# Altium schematic sheet 智能灯.SchDoc
size A3
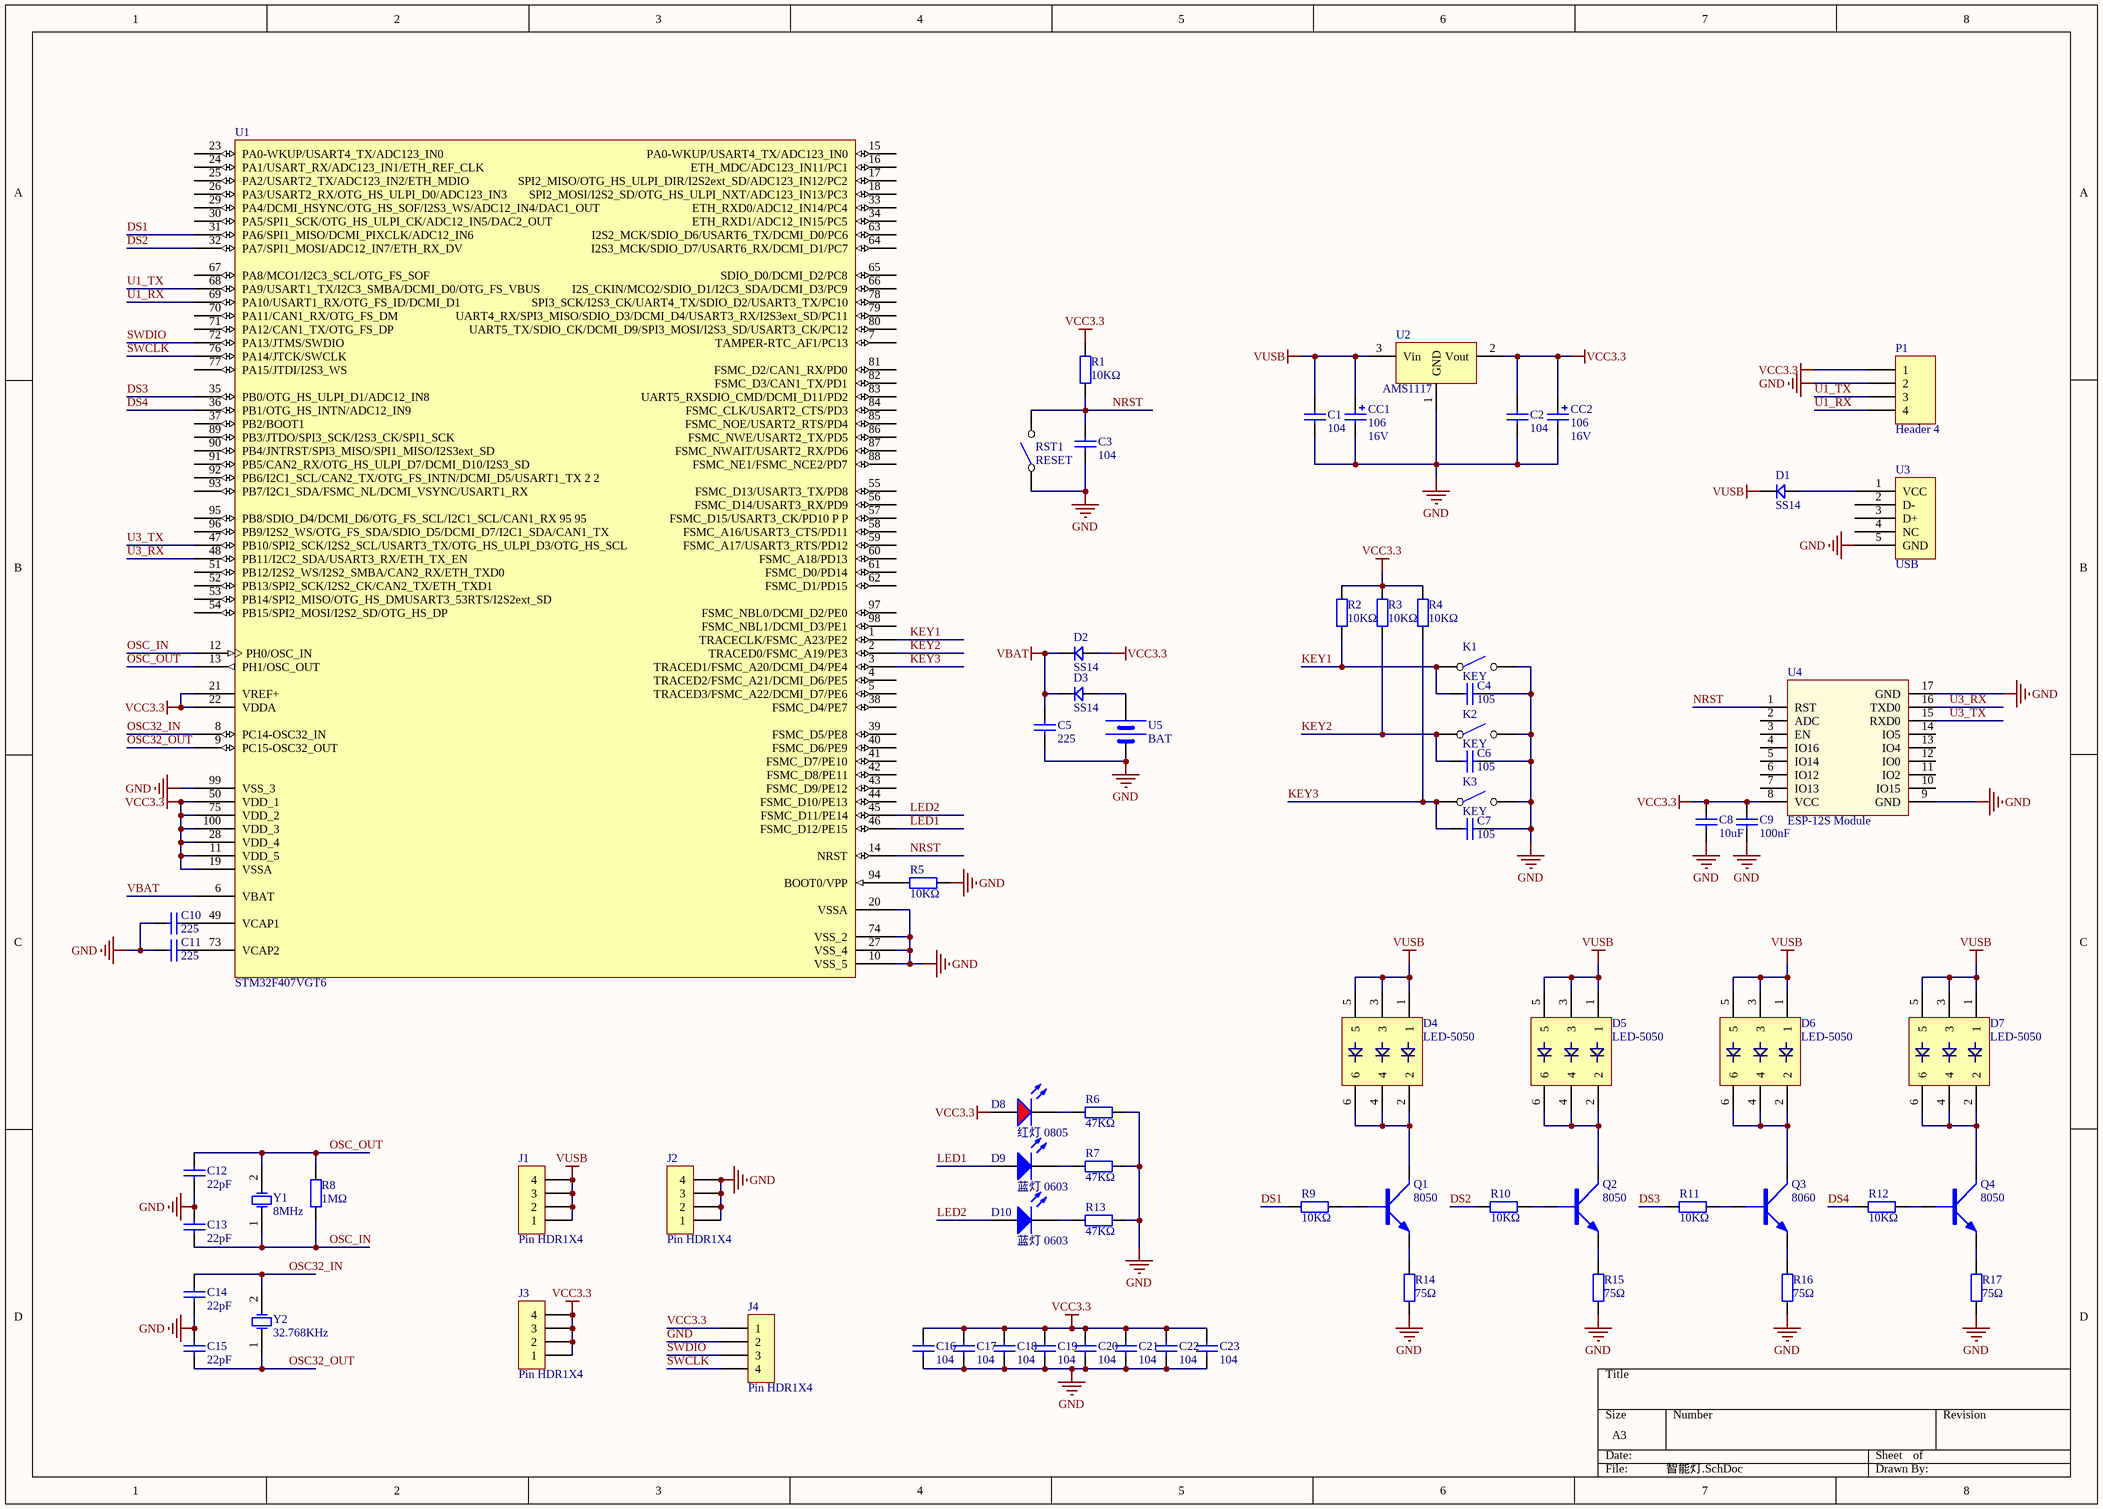
[diagram p0: 智能灯.SchDoc]

## Parts
C1  104  [LC-0805_C]
C2  104  [LC-0805_C]
C3  104  [LC-0805_C]
C4  105  [LC-0805_C]
C5  225  [LC-0805_C]
C6  105  [LC-0805_C]
C7  105  [LC-0805_C]
C8  10uF  [LC-0805_C]
C9  100nF  [LC-0805_C]
C10  225  [LC-0805_C]
C11  225  [LC-0805_C]
C12  22pF  [LC-0805_C]
C13  22pF  [LC-0805_C]
C14  22pF  [LC-0805_C]
C15  22pF  [LC-0805_C]
C16  104  [LC-0805_C]
C17  104  [LC-0805_C]
C18  104  [LC-0805_C]
C19  104  [LC-0805_C]
C20  104  [LC-0805_C]
C21  104  [LC-0805_C]
C22  104  [LC-0805_C]
C23  104  [LC-0805_C]
CC1  Capacitance: 106  Voltage: 16V  [TAN-C-6032]  (hidden comment: Cap Tan C)
CC2  Capacitance: 106  Voltage: 16V  [TAN-C-6032]  (hidden comment: Cap Tan C)
D1  SS14  [LC-SOD-123]
D2  SS14  [LC-SOD-123]
D3  SS14  [LC-SOD-123]
D4  LED-5050  [LED-5050W]
D5  LED-5050  [LED-5050W]
D6  LED-5050  [LED-5050W]
D7  LED-5050  [LED-5050W]
D8  红灯 0805  [LC-0805_LED_S1]
D9  蓝灯 0603  [LC-0805_LED_S1]
D10  蓝灯 0603  [LC-0805_LED_S1]
J1  Pin HDR1X4  [Pin HDR1X4/2.54mm-S]
J2  Pin HDR1X4  [Pin HDR1X4/2.54mm-S]
J3  Pin HDR1X4  [Pin HDR1X4/2.54mm-S]
J4  Pin HDR1X4  [Pin HDR1X4/2.54mm-S]
K1  KEY  [KEY_2]
K2  KEY  [KEY_2]
K3  KEY  [KEY_2]
P1  Header 4  [HDR1X4]
Q1  8050  [SOT-23]
Q2  8050  [SOT-23]
Q3  8060  [SOT-23]
Q4  8050  [SOT-23]
R1  10KΩ  [LC-0805_R]
R2  10KΩ  [LC-0805_R]
R3  10KΩ  [LC-0805_R]
R4  10KΩ  [LC-0805_R]
R5  10KΩ  [LC-0805_R]
R6  47KΩ  [LC-0805_R]
R7  47KΩ  [LC-0805_R]
R8  1MΩ  [LC-0805_R]
R9  10KΩ  [LC-0805_R]
R10  10KΩ  [0805R]
R11  10KΩ  [0805R]
R12  10KΩ  [0805R]
R13  47KΩ  [LC-0805_R]
R14  75Ω  [0805R]
R15  75Ω  [0805R]
R16  75Ω  [0805R]
R17  75Ω  [0805R]
RST1  RESET  [KEY_2]
U1  STM32F407VGT6  [LQFP100 14x14]
U2  AMS1117  [SOT-223]
U3  USB  [USB_B]
U4  ESP-12S Module  [ESP-12S Module]
U5  BAT  [CR1220_A]
Y1  8MHz  [XTAL-SMD]
Y2  32.768KHz  [OSC-3x8-WI-B]

## Nets
GND: C1.1 C2.1 C3.1 C4.2 C5.1 C6.2 C7.2 C8.1 C9.1 C10.1 C11.1 C12.1 C13.2 C14.1 C15.2 C16.1 C17.1 C18.1 C19.1 C20.1 C21.1 C22.1 C23.1 CC1.1 CC2.1 J2.1 J2.2 J2.3 J2.4 J4.2 K1.2 K2.2 K3.2 P1.2 R5.2 R6.2 R7.2 R13.2 R14.2 R15.2 R16.2 R17.2 RST1.1 U1.10(VSS_5) U1.20(VSSA) U1.27(VSS_4) U1.74(VSS_2) U1.99(VSS_3) U2.1(GND) U3.5(GND) U4.9(GND) U4.17(GND) U5.2(GND)
VBAT: C5.2 D2.2 D3.2 U1.6(VBAT)
VCC3.3: C2.2 C8.2 C9.2 C16.2 C17.2 C18.2 C19.2 C20.2 C21.2 C22.2 C23.2 CC2.2 D2.1 D8.A J3.1 J3.2 J3.3 J3.4 J4.1 P1.1 R1.2 R2.2 R3.2 R4.2 U1.11(VDD_5) U1.19(VSSA) U1.21(VREF+) U1.22(VDDA) U1.28(VDD_4) U1.50(VDD_1) U1.75(VDD_2) U1.100(VDD_3) U2.2(Vout) U4.8(VCC)
VUSB: C1.2 CC1.2 D1.2 D4.1 D4.3 D4.5 D5.1 D5.3 D5.5 D6.1 D6.3 D6.5 D7.1 D7.3 D7.5 J1.1 J1.2 J1.3 J1.4 U2.3(Vin)
DS1: R9.2 U1.31(PA6/SPI1_MISO/DCMI_PIXCLK/ADC12_IN6)
DS2: R10.2 U1.32(PA7/SPI1_MOSI/ADC12_IN7/ETH_RX_DV)
DS3: R11.2 U1.35(PB0/OTG_HS_ULPI_D1/ADC12_IN8)
DS4: R12.2 U1.36(PB1/OTG_HS_INTN/ADC12_IN9)
KEY1: C4.1 K1.1 R2.1 U1.1(TRACECLK/FSMC_A23/PE2)
KEY2: C6.1 K2.1 R3.1 U1.2(TRACED0/FSMC_A19/PE3)
KEY3: C7.1 K3.1 R4.1 U1.3(TRACED1/FSMC_A20/DCMI_D4/PE4)
LED1: D9.A U1.46(FSMC_D12/PE15)
LED2: D10.A U1.45(FSMC_D11/PE14)
NRST: C3.2 R1.1 RST1.2 U1.14(NRST) U4.1(RST)
OSC32_IN: C14.2 U1.8(PC14-OSC32_IN) Y2.2(OSC2)
OSC32_OUT: C15.1 U1.9(PC15-OSC32_OUT) Y2.1(OSC1)
OSC_IN: C13.1 R8.1 U1.12(PH0/OSC_IN) Y1.1(OSC1)
OSC_OUT: C12.2 R8.2 U1.13(PH1/OSC_OUT) Y1.2(OSC2)
SWCLK: J4.4 U1.76(PA14/JTCK/SWCLK)
SWDIO: J4.3 U1.72(PA13/JTMS/SWDIO)
U1_RX: P1.4 U1.69(PA10/USART1_RX/OTG_FS_ID/DCMI_D1)
U1_TX: P1.3 U1.68(PA9/USART1_TX/I2C3_SMBA/DCMI_D0/OTG_FS_VBUS)
U3_RX: U1.48(PB11/I2C2_SDA/USART3_RX/ETH_TX_EN) U4.16(TXD0)
U3_TX: U1.47(PB10/SPI2_SCK/I2S2_SCL/USART3_TX/OTG_HS_ULPI_D3/OTG_HS_SCL) U4.15(RXD0)
NetC10_2: C10.2 U1.49(VCAP1)
NetC11_2: C11.2 U1.73(VCAP2)
NetD1_1: D1.1 U3.1(VCC)
NetD3_1: D3.1 U5.1(VCC)
NetD4_2: D4.2 D4.4 D4.6 Q1.C
NetD5_2: D5.2 D5.4 D5.6 Q2.C
NetD6_2: D6.2 D6.4 D6.6 Q3.C
NetD7_2: D7.2 D7.4 D7.6 Q4.C
NetD8_K: D8.K R6.1
NetD9_K: D9.K R7.1
NetD10_K: D10.K R13.1
NetQ1_B: Q1.B R9.1
NetQ1_E: Q1.E R14.1
NetQ2_B: Q2.B R10.1
NetQ2_E: Q2.E R15.1
NetQ3_B: Q3.B R11.1
NetQ3_E: Q3.E R16.1
NetQ4_B: Q4.B R12.1
NetQ4_E: Q4.E R17.1
NetR5_1: R5.1 U1.94(BOOT0/VPP)

Not connected (* = marked no-connect by the designer): U1 4(TRACED2/FSMC_A21/DCMI_D6/PE5) 5(TRACED3/FSMC_A22/DCMI_D7/PE6) 7(TAMPER-RTC_AF1/PC13) 15(PA0-WKUP/USART4_TX/ADC123_IN0) 16(ETH_MDC/ADC123_IN11/PC1) 17(SPI2_MISO/OTG_HS_ULPI_DIR/I2S2ext_SD/ADC123_IN12/PC2) 18(SPI2_MOSI/I2S2_SD/OTG_HS_ULPI_NXT/ADC123_IN13/PC3) 23(PA0-WKUP/USART4_TX/ADC123_IN0) 24(PA1/USART_RX/ADC123_IN1/ETH_REF_CLK) 25(PA2/USART2_TX/ADC123_IN2/ETH_MDIO) 26(PA3/USART2_RX/OTG_HS_ULPI_D0/ADC123_IN3) 29(PA4/DCMI_HSYNC/OTG_HS_SOF/I2S3_WS/ADC12_IN4/DAC1_OUT) 30(PA5/SPI1_SCK/OTG_HS_ULPI_CK/ADC12_IN5/DAC2_OUT) 33(ETH_RXD0/ADC12_IN14/PC4) 34(ETH_RXD1/ADC12_IN15/PC5) 37(PB2/BOOT1) 38(FSMC_D4/PE7) 39(FSMC_D5/PE8) 40(FSMC_D6/PE9) 41(FSMC_D7/PE10) 42(FSMC_D8/PE11) 43(FSMC_D9/PE12) 44(FSMC_D10/PE13) 51(PB12/I2S2_WS/I2S2_SMBA/CAN2_RX/ETH_TXD0) 52(PB13/SPI2_SCK/I2S2_CK/CAN2_TX/ETH_TXD1) 53(PB14/SPI2_MISO/OTG_HS_DMUSART3_53RTS/I2S2ext_SD) 54(PB15/SPI2_MOSI/I2S2_SD/OTG_HS_DP) 55(FSMC_D13/USART3_TX/PD8) 56(FSMC_D14/USART3_RX/PD9) 57(FSMC_D15/USART3_CK/PD10_P_P) 58(FSMC_A16/USART3_CTS/PD11) 59(FSMC_A17/USART3_RTS/PD12) 60(FSMC_A18/PD13) 61(FSMC_D0/PD14) 62(FSMC_D1/PD15) 63(I2S2_MCK/SDIO_D6/USART6_TX/DCMI_D0/PC6) 64(I2S3_MCK/SDIO_D7/USART6_RX/DCMI_D1/PC7) 65(SDIO_D0/DCMI_D2/PC8) 66(I2S_CKIN/MCO2/SDIO_D1/I2C3_SDA/DCMI_D3/PC9) 67(PA8/MCO1/I2C3_SCL/OTG_FS_SOF) 70(PA11/CAN1_RX/OTG_FS_DM) 71(PA12/CAN1_TX/OTG_FS_DP) 77(PA15/JTDI/I2S3_WS) 78(SPI3_SCK/I2S3_CK/UART4_TX/SDIO_D2/USART3_TX/PC10) 79(UART4_RX/SPI3_MISO/SDIO_D3/DCMI_D4/USART3_RX/I2S3ext_SD/PC11) 80(UART5_TX/SDIO_CK/DCMI_D9/SPI3_MOSI/I2S3_SD/USART3_CK/PC12) 81(FSMC_D2/CAN1_RX/PD0) 82(FSMC_D3/CAN1_TX/PD1) 83(UART5_RXSDIO_CMD/DCMI_D11/PD2) 84(FSMC_CLK/USART2_CTS/PD3) 85(FSMC_NOE/USART2_RTS/PD4) 86(FSMC_NWE/USART2_TX/PD5) 87(FSMC_NWAIT/USART2_RX/PD6) 88(FSMC_NE1/FSMC_NCE2/PD7) 89(PB3/JTDO/SPI3_SCK/I2S3_CK/SPI1_SCK) 90(PB4/JNTRST/SPI3_MISO/SPI1_MISO/I2S3ext_SD) 91(PB5/CAN2_RX/OTG_HS_ULPI_D7/DCMI_D10/I2S3_SD) 92(PB6/I2C1_SCL/CAN2_TX/OTG_FS_INTN/DCMI_D5/USART1_TX_2_2) 93(PB7/I2C1_SDA/FSMC_NL/DCMI_VSYNC/USART1_RX) 95(PB8/SDIO_D4/DCMI_D6/OTG_FS_SCL/I2C1_SCL/CAN1_RX_95_95) 96(PB9/I2S2_WS/OTG_FS_SDA/SDIO_D5/DCMI_D7/I2C1_SDA/CAN1_TX) 97(FSMC_NBL0/DCMI_D2/PE0) 98(FSMC_NBL1/DCMI_D3/PE1); U3 2(D-) 3(D+) 4(NC); U4 2(ADC) 3(EN) 4(IO16) 5(IO14) 6(IO12) 7(IO13) 10(IO15) 11(IO2) 12(IO0) 13(IO4) 14(IO5)

## Library data of the parts
C1 C2 C4-C11 C16-C23 = 0805 6.8nF (682) 10% 50V: 贴片电容; ComponentLink1Description: 供应商链接; ComponentLink1URL: http://www.szlcsc.com/product/details_2107.html; Package: 0805; Supplier: LC; SuppliersPartNumber: C1755
C3 = 0805 330nF (334) 10% 50V: 贴片电容; ComponentLink1Description: 供应商链接; ComponentLink1URL: http://www.szlcsc.com/product/details_2092.html; Package: 0805; Supplier: LC; SuppliersPartNumber: C1740
C12-C15 = 0805 6pF (6R0) 0.25pF 50V: 贴片电容; ComponentLink1Description: 供应商链接; ComponentLink1URL: http://www.szlcsc.com/product/details_68656.html; Package: 0805; Supplier: LC; SuppliersPartNumber: C67560
CC1 CC2 = Cap Tan C: Polarized Capacitor (Radial); Published: 8-Jun-2000; Revision: July-2002: Re-released for DXP Platform.; Publisher: Altium Limited
D1-D3 = D
D8 = 0805 红灯: 发光二极管; ComponentLink1Description: 供应商链接; ComponentLink1URL: http://www.szlcsc.com/product/details_2668.html; Package: 0805; Supplier: LC; SuppliersPartNumber: C2295
D9 D10 = 0603 蓝灯: 发光二极管; ComponentLink1Description: 供应商链接; ComponentLink1URL: http://www.szlcsc.com/product/details_73150.html; Package: 0603; Supplier: LC; SuppliersPartNumber: C72041
K1-K3 RST1 = KEY: 微动开关
P1 = Header 4: Header, 4-Pin; LatestRevisionDate: 17-Jul-2002; LatestRevisionNote: Re-released for DXP Platform.; Publisher: Altium Limited
Q1-Q4 = NPN: NPN三极管
R1 R8 = 0805 390KΩ (3903) 1%: 贴片电阻; ComponentLink1Description: 供应商链接; ComponentLink1URL: http://www.szlcsc.com/product/details_18344.html; Package: 0805; Supplier: LC; SuppliersPartNumber: C17656
R2-R4 R6 R7 R9-R13 = 0805 11KΩ (1102) 1%: 贴片电阻; ComponentLink1Description: 供应商链接; ComponentLink1URL: http://www.szlcsc.com/product/details_18117.html; Package: 0805; Supplier: LC; SuppliersPartNumber: C17429
R5 = 0805 1.8KΩ (1801) 1%: 贴片电阻; ComponentLink1Description: 供应商链接; ComponentLink1URL: http://www.szlcsc.com/product/details_18086.html; Package: 0805; Supplier: LC; SuppliersPartNumber: C17398
R14-R17 = 0805 1.2KΩ (1201) 1%: 贴片电阻; ComponentLink1Description: 供应商链接; ComponentLink1URL: http://www.szlcsc.com/product/details_18067.html; Package: 0805; Supplier: LC; SuppliersPartNumber: C17379
U2 = AMS1117: 3.3V电压转换器AMS1117
U5 = BAT: 纽扣电池座CR1220
Y1 Y2 = XTAL: 晶体振荡器; Published: 8-Jun-2000; LatestRevisionDate: 17-Jul-2002; LatestRevisionNote: Re-released for DXP Platform.; PackageReference: R38; Publisher: Altium Limited